# Altium schematic sheet PSU.SchDoc
size A4
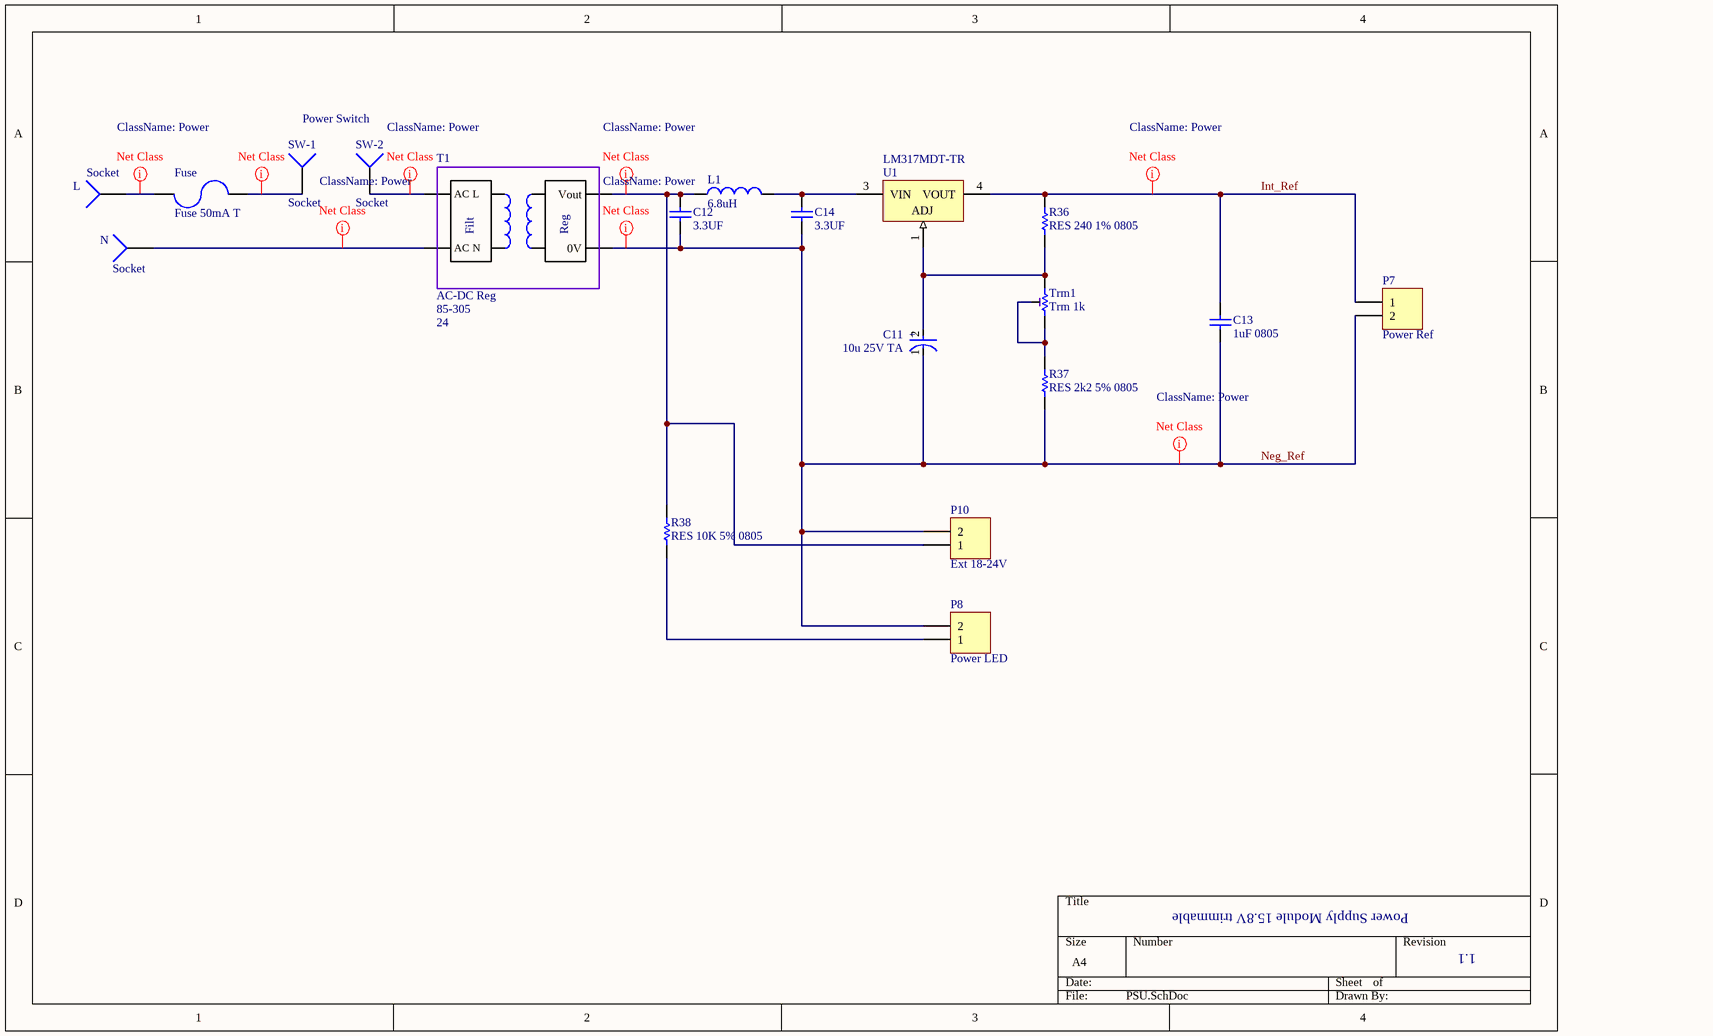
[diagram p0: PSU.SchDoc]

## Parts
C11  10u 25V TA  [FP-TPE-D4-MFG]
C12  3.3UF  [CAPC1206(3216)150_L]
C13  1uF 0805  [CAPC2113X88X50NL30T25]
C14  3.3UF  [CAPC1206(3216)150_L]
Fuse  Fuse 50mA T  [Fuse Holder 20mm PCB with Cover]
L  Socket  [PIN1]
L1  6.8uH  [2.5x2 Inductor]
N  Socket  [PIN1]
P7  Power Ref  [HDR1X2]
P8  Power LED  [HDR1X2]
P10  Ext 18-24V  [HDR1X2]
R36  RES 240 1% 0805  [RESC2013X70X40LL20T20]
R37  RES 2k2 5% 0805  [RESC2013X70X40LL20T20]
R38  RES 10K 5% 0805  [RESC2013X70X40LL20T20]
SW-1  Socket  [PIN1]
SW-2  Socket  [PIN1]
T1  AC-DC Reg  VACin: 85-305  VDC Out: 24  [IRM-02 Moule SM]
Trm1  Trm 1k  [3214W Trimmer]
U1  LM317MDT-TR  [TO-252_L]

## Nets
Int_Ref: C13.1 P7.1 R36.2 U1.4(VOUT)
Neg_Ref: C11.1(C) C12.1 C13.2 C14.1 P7.2 P8.2 P10.2 R37.1 T1.0V
NetC11_2: C11.2(A) R36.1 Trm1.3 U1.1(ADJ)
NetC12_2: C12.2 L1.1 P10.1 R38.2 T1.Vout
NetC14_2: C14.2 L1.2 U1.3(VIN)
NetFuse_1: Fuse.1 L.1
NetFuse_2: Fuse.2 SW-1.1
NetN_1: N.1 T1.N(AC_N)
NetP8_1: P8.1 R38.1
NetR37_2: R37.2 Trm1.1 Trm1.2
NetSW-2_1: SW-2.1 T1.L(AC_L)

## Layout directives
net class Power: Int_Ref, Neg_Ref, NetC12_2, NetFuse_1, NetFuse_2, NetN_1, NetSW-2_1

## Notes on the sheet
- Power Switch
- Power Supply Module 15.8V trimmable
- 1.1
- (in symbol AC-DC Reg Module) Filt; Reg
- (in symbol CMP-05428-000010-1) +

## Library data of the parts
C11 = CMP-05428-000010-1: CAP TANT 10u 25V; Manufacturer Part Number: 6TPE330MAA; Manufacturer: Panasonic Electronic; Tolerance: 20%; Ripple Current: 4400mA; Life: 1000Hours; Leakage Current: 207.9uA; Esr: 10mΩ; Material: Polymer; Dissipation Factor: 10%; Capacitance: 330uF; Temperature Range High: +105°C; Mouser Description: Tantalum Capacitors - Polymer SMD 6.3volts 330uF ESR 10mohm; Device Class L3: Polymer Capacitors; ComponentLink2URL: https://industrial.panasonic.com/cdbs/www-data/pdf/AAA8000/AAA8000C36.pdf; Digikey Description: CAP TANT POLY 330UF 6.3V 2917; Value: 10U; Temperature: -55°C to +105°C; Category: Cap; Voltage Rating: 25v; Package: TPE-D4; Temperature Range Low: -55°C; Footprint Url: https://industrial.panasonic.com/cdbs/www-data/pdf/AAA8000/AAA8000COL85.pdf; Height: 4mm; Octopart: https://octopart.com/6tpe330maa-panasonic-29487875; ComponentLink2Description: Datasheet; Device Class L1: Passive Components; Device Class L2: Capacitors; Lead Free: Yes; RoHS: TRUE; Automotive: No
C12 C14 = CMP-1590-00001-1: 1206 (3216 Metric) Chip Capacitor; Case-Metric: 3216; Case-EIA: 1206; PackageReference: CAPC1206(3216)150
C13 = CMP-2007-00001-1: Manufacturer: Kemet; Part Number: C0805X474K4RACTU
Fuse = Fuse
L1 = Inductor: Inductor 6.8uH
P7 P8 P10 = Header 2: Header, 2-Pin; LatestRevisionDate: 17-Jul-2002; LatestRevisionNote: Re-released for DXP Platform.; Publisher: Altium Limited
R36 = CMP-2001-00110-5: Resistor 240 1% 0805  0.2W 10ppm/C; Manufacturer: Panasonic; Voltage Rating: 150 V; Package Quantity: 5000; PackageDescription: 2-Pin Surface Mount Device, Body 2 x 1.25 mm; Mounting Technology: Surface Mount; ComponentLink2URL: http://industrial.panasonic.com/cdbs/www-data/pdf/RDA0000/AOA0000C86.pdf; DatasheetVersion: 04/2015; ComponentLink1URL: http://www.panasonic.com/; Mount: Surface Mount; ComponentLink1Description: Manufacturer URL; RoHSCompliant: true; PackageReference: 0805; Min Operating Temperature: -55 degC; Height: 0.6 mm; ComponentLink2Description: Datasheet; Max Operating Temperature: 155 degC; Length: 2 mm; Packaging: Tape and Reel; REACH SVHC: Yes
R37 = CMP-2001-00110-5: Resistor 2k2 5% 0805  0.2W 10ppm/C; Manufacturer: Panasonic; Voltage Rating: 150 V; Package Quantity: 5000; PackageDescription: 2-Pin Surface Mount Device, Body 2 x 1.25 mm; Mounting Technology: Surface Mount; ComponentLink2URL: http://industrial.panasonic.com/cdbs/www-data/pdf/RDA0000/AOA0000C86.pdf; DatasheetVersion: 04/2015; ComponentLink1URL: http://www.panasonic.com/; Mount: Surface Mount; ComponentLink1Description: Manufacturer URL; RoHSCompliant: true; PackageReference: 0805; Min Operating Temperature: -55 degC; Height: 0.6 mm; ComponentLink2Description: Datasheet; Max Operating Temperature: 155 degC; Length: 2 mm; Packaging: Tape and Reel; REACH SVHC: Yes
R38 = CMP-2001-00110-5: Resistor 10K 5% 0805  0.2W 50ppm/C; Manufacturer: Panasonic; Voltage Rating: 50V; Package Quantity: 5000; PackageDescription: 2-Pin Surface Mount Device, Body 2 x 1.25 mm; Mounting Technology: Surface Mount; ComponentLink2URL: http://industrial.panasonic.com/cdbs/www-data/pdf/RDA0000/AOA0000C86.pdf; DatasheetVersion: 04/2015; ComponentLink1URL: http://www.panasonic.com/; Mount: Surface Mount; ComponentLink1Description: Manufacturer URL; RoHSCompliant: true; PackageReference: 0805; Min Operating Temperature: -55 degC; Height: 0.6 mm; ComponentLink2Description: Datasheet; Max Operating Temperature: 155 degC; Length: 2 mm; Packaging: Tape and Reel; REACH SVHC: Yes
T1 = AC-DC Reg Module: AC-DC Regulated Module 24V; pin to pad: 0V>13 L>1 N>24 Vout>12; Model: *; Make: *
Trm1 = Trimmer
U1 = CMP-0244-00074-1: 500mA, Medium Current 1.2 to 37 V Adjustable Voltage Regulator, 3-Pin DPAK, Tape and Reel; DatasheetVersion: 1/02/2008; ComponentLink1Description: Manufacturer URL; PackageReference: TO-252; ComponentLink2Description: Datasheet; PackageDescription: 3-Pin Transistor Outline Package 2.28 mm Pitch, 9.7 mm Lead Span (DPAK); ComponentLink2URL: http://www.st.com/internet/com/TECHNICAL_RESOURCES/TECHNICAL_LITERATURE/DATASHEET/CD00000549.pdf; PackageVersion: 2011; ComponentLink1URL: http://www.st.com
L N SW-1 SW-2 = Socket: LatestRevisionDate: 17-Jul-2002; LatestRevisionNote: Re-released for DXP Platform.; Publisher: Altium Limited